# EAGLE design sr_indicator_v0_revA (EAGLE 6.3)
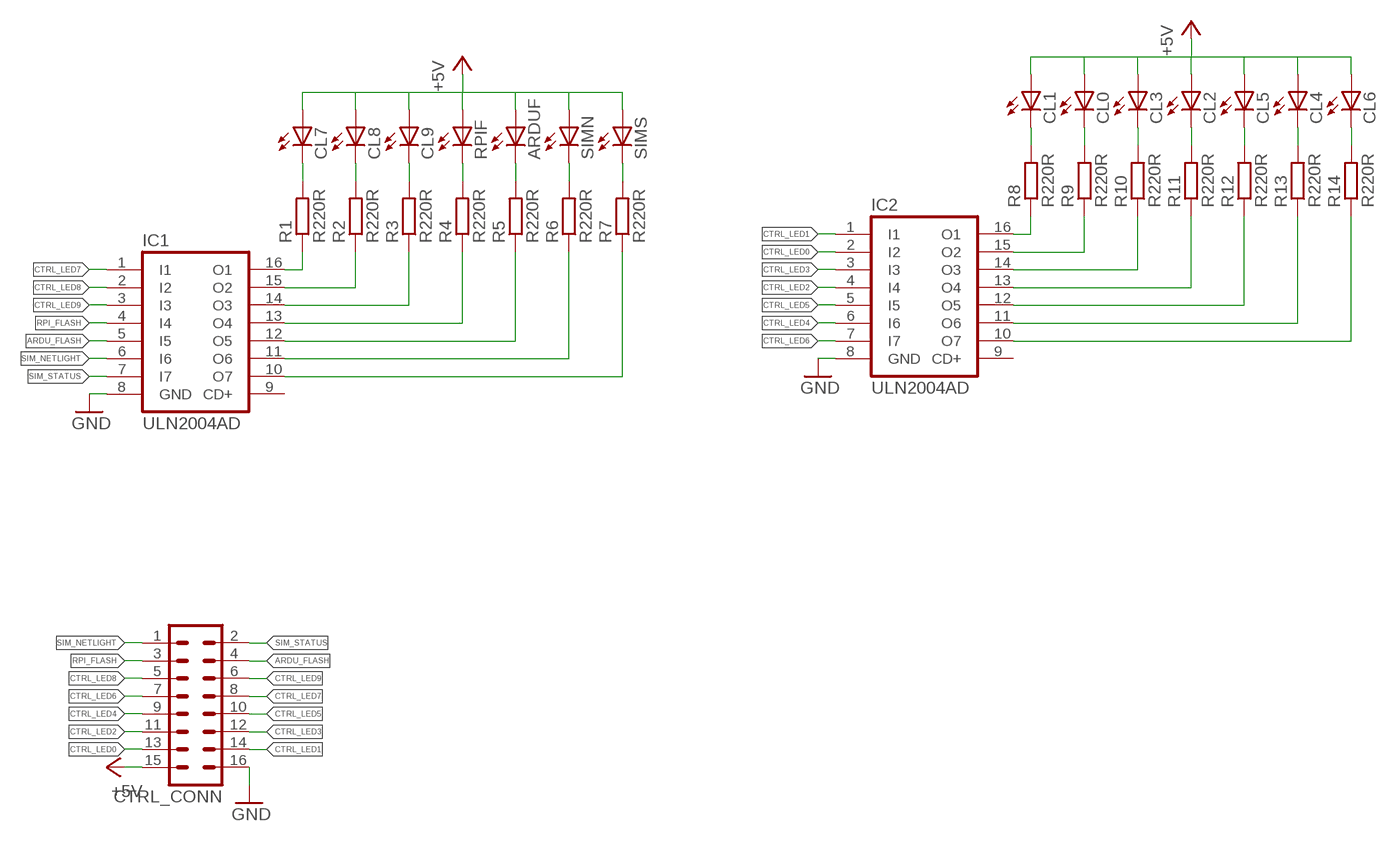
[diagram p0: schematic, sheet 1]

## Parts
ARDUF  LED3MM  [LED3MM]
CL0  LED3MM  [LED3MM]
CL1  LED3MM  [LED3MM]
CL2  LED3MM  [LED3MM]
CL3  LED3MM  [LED3MM]
CL4  LED3MM  [LED3MM]
CL5  LED3MM  [LED3MM]
CL6  LED3MM  [LED3MM]
CL7  LED3MM  [LED3MM]
CL8  LED3MM  [LED3MM]
CL9  LED3MM  [LED3MM]
CTRL_CONN  MA08-2  [MA08-2]
IC1  ULN2004AD  [SO16]
IC2  ULN2004AD  [SO16]
R1  R220R  R-EU_M0805  [M0805]
R2  R220R  R-EU_M0805  [M0805]
R3  R220R  R-EU_M0805  [M0805]
R4  R220R  R-EU_M0805  [M0805]
R5  R220R  R-EU_M0805  [M0805]
R6  R220R  R-EU_M0805  [M0805]
R7  R220R  R-EU_M0805  [M0805]
R8  R220R  R-EU_M0805  [M0805]
R9  R220R  R-EU_M0805  [M0805]
R10  R220R  R-EU_M0805  [M0805]
R11  R220R  R-EU_M0805  [M0805]
R12  R220R  R-EU_M0805  [M0805]
R13  R220R  R-EU_M0805  [M0805]
R14  R220R  R-EU_M0805  [M0805]
RPIF  LED3MM  [LED3MM]
SIMN  LED3MM  [LED3MM]
SIMS  LED3MM  [LED3MM]

## Nets
+5V: ARDUF.A CL0.A CL1.A CL2.A CL3.A CL4.A CL5.A CL6.A CL7.A CL8.A CL9.A CTRL_CONN.15 RPIF.A SIMN.A SIMS.A
ARDU_FLASH: CTRL_CONN.4 IC1.5(I5)
CTRL_LED0: CTRL_CONN.13 IC2.2(I2)
CTRL_LED1: CTRL_CONN.14 IC2.1(I1)
CTRL_LED2: CTRL_CONN.11 IC2.4(I4)
CTRL_LED3: CTRL_CONN.12 IC2.3(I3)
CTRL_LED4: CTRL_CONN.9 IC2.6(I6)
CTRL_LED5: CTRL_CONN.10 IC2.5(I5)
CTRL_LED6: CTRL_CONN.7 IC2.7(I7)
CTRL_LED7: CTRL_CONN.8 IC1.1(I1)
CTRL_LED8: CTRL_CONN.5 IC1.2(I2)
CTRL_LED9: CTRL_CONN.6 IC1.3(I3)
GND: CTRL_CONN.16 IC1.8(GND) IC2.8(GND)
N$1: IC1.16(O1) R1.1
N$2: IC1.15(O2) R2.1
N$3: IC1.14(O3) R3.1
N$4: IC1.13(O4) R4.1
N$5: IC1.12(O5) R5.1
N$6: IC1.11(O6) R6.1
N$7: IC1.10(O7) R7.1
N$8: CL7.K(C) R1.2
N$9: CL8.K(C) R2.2
N$10: CL9.K(C) R3.2
N$11: R4.2 RPIF.K(C)
N$12: ARDUF.K(C) R5.2
N$13: R6.2 SIMN.K(C)
N$14: R7.2 SIMS.K(C)
N$15: IC2.16(O1) R8.1
N$16: IC2.15(O2) R9.1
N$17: IC2.14(O3) R10.1
N$18: IC2.13(O4) R11.1
N$19: IC2.12(O5) R12.1
N$20: IC2.11(O6) R13.1
N$21: IC2.10(O7) R14.1
N$22: CL1.K(C) R8.2
N$23: CL0.K(C) R9.2
N$24: CL3.K(C) R10.2
N$25: CL2.K(C) R11.2
N$26: CL5.K(C) R12.2
N$27: CL4.K(C) R13.2
N$28: CL6.K(C) R14.2
RPI_FLASH: CTRL_CONN.3 IC1.4(I4)
SIM_NETLIGHT: CTRL_CONN.1 IC1.6(I6)
SIM_STATUS: CTRL_CONN.2 IC1.7(I7)
Unconnected: IC1.9(CD+) IC2.9(CD+)

## Library data of the parts
ARDUF CL0 CL1-CL9 RPIF SIMN SIMS = adafruit:LED: LED OSRAM: - CHIPLED LG R971, LG N971, LY N971, LG Q971, LY Q971, LO R971, LY R971 LH N974, LH R974 LS Q976, LO Q976, LY Q976 LO Q996 - Hyper CHIPLED LW Q18S LB Q993, LB Q99A, LB R99A - SideLED LS A670, LO A670, LY A670, LG A670, LP A670 LB A673, LV A673, LT A673, LW A673 LH A674 LY A675 LS A676, LA A676, LO A676, LY A676, LW A676 LS A679, LY A679, LG A679 - Hyper Micro SIDELED® LS Y876, LA Y876, LO Y876, LY Y876 LT Y87S - SmartLED LW L88C, LW L88S LB L89C, LB L89S, LG L890 LS L89K, LO L89K, LY L89K LS L896, LA L896, LO L896, LY L896 - TOPLED LS T670, LO T670, LY T670, LG T670, LP T670 LSG T670, LSP T670, LSY T670, LOP T670, LYG T670 LG T671, LOG T671, LSG T671 LB T673, LV T673, LT T673, LW T673 LH T674 LS T676, LA T676, LO T676, LY T676, LB T676, LH T676, LSB T676, LW T676 LB T67C, LV T67C, LT T67C, LS T67K, LO T67K, LY T67K, LW E67C LS E67B, LA E67B, LO E67B, LY E67B, LB E67C, LV E67C, LT E67C LW T67C LS T679, LY T679, LG T679 LS T770, LO T770, LY T770, LG T770, LP T770 LB T773, LV T773, LT T773, LW T773 LH T774 LS E675, LA E675, LY E675, LS T675 LS T776, LA T776, LO T776, LY T776, LB T776 LHGB T686 LT T68C, LB T68C - Hyper Mini TOPLED® LB M676 - Mini TOPLED Santana® LG M470 LS M47K, LO M47K, LY M47K Source: http://www.osram.convergy.de/
CTRL_CONN = con-lstb:MA08-2: PIN HEADER; OC_FARNELL: unknown; OC_NEWARK: unknown
IC1 IC2 = uln-udn:ULN2004A: DRIVER ARRAY
R1-R14 = resistor:R-EU_: RESISTOR, European symbol

## Board
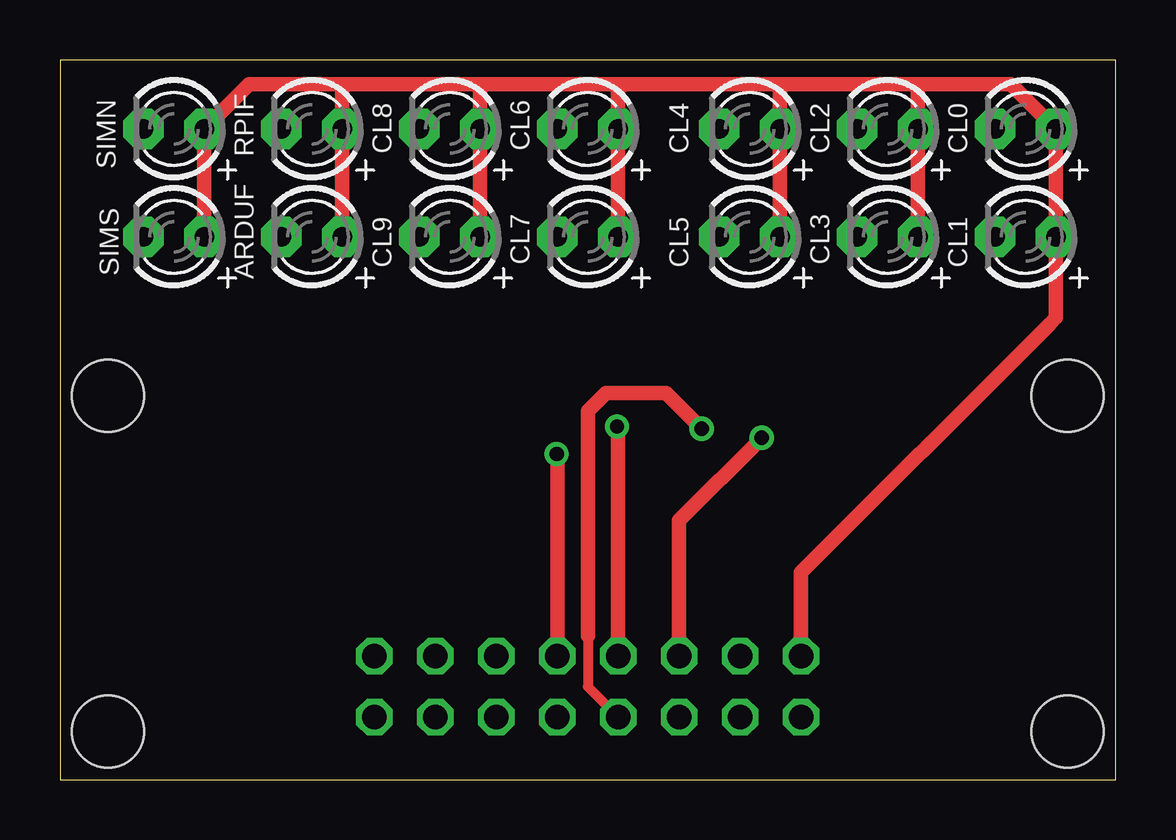
[diagram p1: board, top side]
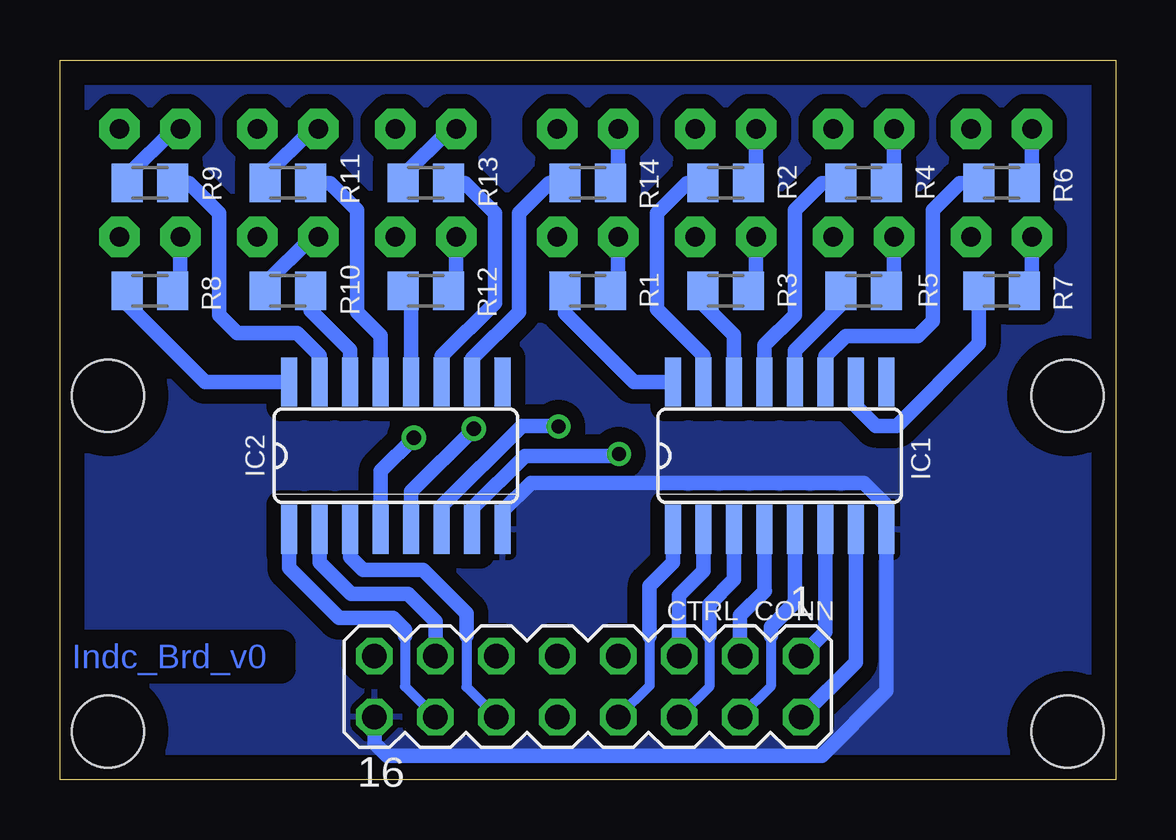
[diagram p2: board, bottom side, seen from below]

Size 44 x 30 mm. Coordinates in mm from the lower left corner, seen from the top.
Outline: 0,0 44,0 44,30 0,30 0,0
Copper layers (1*16): Top 0.035mm / dielectric 1.5mm / Bottom 0.035mm
Design rules "default": minimum track width 10mil, minimum drill 24mil, track to track 8mil, track to pad 8mil, pad to pad 8mil, via to via 8mil, smd to smd 8mil, copper to edge 40mil, drill to drill 8mil, minimum pad ring 10mil, minimum via ring 8mil, stop-mask expansion 4mil, vias tented up to drill 0mil, thermal gap 10mil
Holes 3 mm at 2,2 42,2 42,16 2,16

### Footprints (pad centres in the part's own frame; a part is rotated, then mirrored left to right if it is on the bottom)
LED3MM = drill 0.813 pad 1.676 octagon: A -1.27,0; K 1.27,0
MA08-2 = drill 1.016 octagon: 1 -8.89,-1.27; 2 -8.89,1.27; 3 -6.35,-1.27; 4 -6.35,1.27; 5 -3.81,-1.27; 6 -3.81,1.27; 7 -1.27,-1.27; 8 -1.27,1.27; 9 1.27,-1.27; 10 1.27,1.27; 11 3.81,-1.27; 12 3.81,1.27; 13 6.35,-1.27; 14 6.35,1.27; 15 8.89,-1.27; 16 8.89,1.27
SO16 = smd 0.66 x 2.032: 1 -4.445,-3.073; 2 -3.175,-3.073; 3 -1.905,-3.073; 4 -0.635,-3.073; 5 0.635,-3.073; 6 1.905,-3.073; 7 3.175,-3.073; 8 4.445,-3.073; 9 4.445,3.073; 10 3.175,3.073; 11 1.905,3.073; 12 0.635,3.073; 13 -0.635,3.073; 14 -1.905,3.073; 15 -3.175,3.073; 16 -4.445,3.073
M0805 = smd 1.3 x 1.6: 1 -0.95,0; 2 0.95,0

### Placement (x,y rotation side)
ARDUF  10.5,22.62 180 top
CL0  40.25,27.12 180 top
CL1  40.25,22.62 180 top
CL2  34.5,27.12 180 top
CL3  34.5,22.62 180 top
CL4  28.75,27.12 180 top
CL5  28.75,22.62 180 top
CL6  22,27.12 180 top
CL7  22,22.62 180 top
CL8  16.25,27.12 180 top
CL9  16.25,22.62 180 top
CTRL_CONN  22,3.88 180 bottom
IC1  14,13.5 0 bottom
IC2  30,13.5 0 bottom
R1  22,20.38 0 bottom
R2  16.25,24.88 0 bottom
R3  16.25,20.38 0 bottom
R4  10.5,24.88 0 bottom
R5  10.5,20.38 0 bottom
R6  4.75,24.88 0 bottom
R7  4.75,20.38 0 bottom
R8  40.25,20.38 0 bottom
R9  40.25,24.88 180 bottom
R10  34.5,20.38 180 bottom
R11  34.5,24.88 180 bottom
R12  28.75,20.38 0 bottom
R13  28.75,24.88 180 bottom
R14  22,24.88 0 bottom
RPIF  10.5,27.12 180 top
SIMN  4.75,27.12 180 top
SIMS  4.75,22.62 180 top

### Tracks (layer width: path | path; a pad name or v marks a point on that pad's centre or on a via)
+5V
  Top 0.61: SIMS.A SIMN.A 7.89,29 11.62,29 | ARDUF.A RPIF.A 11.77,28.86 11.62,29 | CL9.A CL8.A 17.52,28.89 17.62,29 | CL7.A CL6.A 23.27,28.77 23.5,29 | CL5.A CL4.A 30.02,28.98 30,29 | CL3.A CL2.A 35.77,28.89 35.88,29 | 11.62,29 17.62,29 | 17.62,29 23.5,29 | 23.5,29 30,29 | 30,29 35.88,29 | 35.88,29 39.65,29 CL0.A CL1.A 41.52,19.27 41.25,19 40.88,18.62 30.89,8.64 CTRL_CONN.15
ARDU_FLASH
  Bottom 0.406: 14.38,6 14.38,3.88 CTRL_CONN.4
  Bottom 0.61: 14.38,6 14.38,6.38 13.37,7.38 IC1.5
CTRL_LED0
  Bottom 0.61: CTRL_CONN.13 28.35,6.6 29.5,7.75 31.88,7.75 33.17,9.05 IC2.2
CTRL_LED1
  Bottom 0.406: 29.62,6 29.62,3.88 CTRL_CONN.14
  Bottom 0.61: 29.62,6 29.62,6.25 30.12,6.75 32.38,6.75 34.45,8.82 IC2.1
CTRL_LED2  (via drill 0.6)
  Top 0.61: v29.25,14.25 25.81,10.81 CTRL_CONN.11
  Bottom 0.61: IC2.4 30.64,12.87 v29.25,14.25
CTRL_LED3
  Bottom 0.406: 27.06,6 27.06,3.86 CTRL_CONN.12
  Bottom 0.61: 27.06,6 27.06,6.94 28.88,8.75 31.38,8.75 31.91,9.28 IC2.3
CTRL_LED4  (via drill 0.6)
  Top 0.61: CTRL_CONN.9 23.25,5.17 23.25,14.69 v23.22,14.72
  Bottom 0.61: IC2.6 28.09,11.4 24.75,14.75 23.25,14.75 v23.22,14.72
CTRL_LED5  (via drill 0.6)
  Top 0.406: 22,6 22,3.88 CTRL_CONN.10
  Top 0.61: v26.75,14.62 25.25,16.12 22.75,16.12 22,15.38 22,6
  Bottom 0.61: IC2.5 29.36,12.01 v26.75,14.62
CTRL_LED6  (via drill 0.6)
  Top 0.61: CTRL_CONN.7 20.73,13.54 v20.7,13.57
  Bottom 0.61: IC2.7 26.82,11.3 24.62,13.5 20.77,13.5 v20.7,13.57
CTRL_LED7
  Bottom 0.406: 19.43,5.96 19.43,3.91 CTRL_CONN.8
  Bottom 0.61: 19.43,5.96 19.43,8.07 18.45,9.05 IC1.1
CTRL_LED8
  Bottom 0.61: CTRL_CONN.5 18.19,7.68 17.18,8.7 IC1.2
CTRL_LED9
  Bottom 0.406: 16.94,6 16.94,3.86 CTRL_CONN.6
  Bottom 0.61: 16.94,6 16.94,7.31 15.9,8.35 IC1.3
GND
  Bottom 0.61: CTRL_CONN.16 30.89,1.51 30.38,1 12.25,1 9.55,3.69 IC1.8 9.55,11.43 10.5,12.38 24.38,12.38 25.55,11.2 IC2.8
  pour Bottom (isolate 0.61): 0,30 44,30 44,0 0,0
N$1
  Bottom 0.61: IC1.16 20.07,16.57 22.95,19.45 R1.1
N$2
  Bottom 0.61: IC1.15 17.18,17.68 19.12,19.62 19.12,23.62 17.88,24.88 R2.1
N$3
  Bottom 0.61: R3.1 17.2,19.82 15.9,18.53 IC1.14
N$4
  Bottom 0.61: IC1.13 14.63,18.11 13.38,19.38 13.38,23.75 12.25,24.88 R4.1
N$5
  Bottom 0.61: IC1.12 13.37,17.89 11.45,19.8 R5.1
N$6
  Bottom 0.61: IC1.11 12.1,17.66 11.25,18.5 8.25,18.5 7.62,19.12 7.62,23.75 6.5,24.88 R6.1
N$7
  Bottom 0.61: R7.1 5.7,18.18 9.12,14.75 10,14.75 10.82,15.57 IC1.10
N$8
  Bottom 0.61: CL7.K 20.73,20.7 R1.2
N$9
  Bottom 0.61: CL8.K 14.98,25.2 R2.2
N$10
  Bottom 0.61: CL9.K 14.98,20.7 R3.2
N$11
  Bottom 0.61: RPIF.K 9.23,25.2 R4.2
N$12
  Bottom 0.61: ARDUF.K 9.23,20.7 R5.2
N$13
  Bottom 0.61: SIMN.K 3.48,25.2 R6.2
N$14
  Bottom 0.61: SIMS.K 3.48,20.7 R7.2
N$15
  Bottom 0.61: R8.1 41.2,19.82 37.95,16.57 IC2.16
N$16
  Bottom 0.61: IC2.15 33.17,17.68 34.12,18.62 36.62,18.62 37.38,19.38 37.38,23.62 38.62,24.88 R9.1
N$17
  Bottom 0.61: IC2.14 31.91,17.91 33.55,19.55 R10.1
N$18
  Bottom 0.61: IC2.13 30.64,18.51 31.62,19.5 31.62,23.75 32.75,24.88 R11.1
N$19
  Bottom 0.61: IC2.12 29.36,20.04 R12.1
N$20
  Bottom 0.61: IC2.11 28.09,17.66 25.88,19.88 25.88,23.62 27.12,24.88 R13.1
N$21
  Bottom 0.61: IC2.10 26.82,17.55 24.88,19.5 24.88,23.62 23.62,24.88 R14.1
N$22
  Bottom 0.61: CL1.K 38.98,20.7 R8.2
N$23
  Bottom 0.61: R9.2 41.2,25.18 39.25,27.12 CL0.K
N$24
  Bottom 0.61: R10.2 35.45,20.68 33.5,22.62 CL3.K
N$25
  Bottom 0.61: R11.2 35.45,25.18 33.5,27.12 CL2.K
N$26
  Bottom 0.61: CL5.K 27.48,20.7 R12.2
N$27
  Bottom 0.61: R13.2 29.7,25.18 27.75,27.12 CL4.K
N$28
  Bottom 0.61: CL6.K 20.73,25.2 R14.2
RPI_FLASH
  Bottom 0.61: CTRL_CONN.3 15.65,6.85 14.62,7.88 14.63,7.88 IC1.4
SIM_NETLIGHT
  Bottom 0.61: CTRL_CONN.1 12.1,6.16 IC1.6
SIM_STATUS
  Bottom 0.61: CTRL_CONN.2 10.82,4.89 IC1.7

### Text on the board
Bottom: Indc_Brd_v0